# EAGLE design controller board (EAGLE 9.6.2)
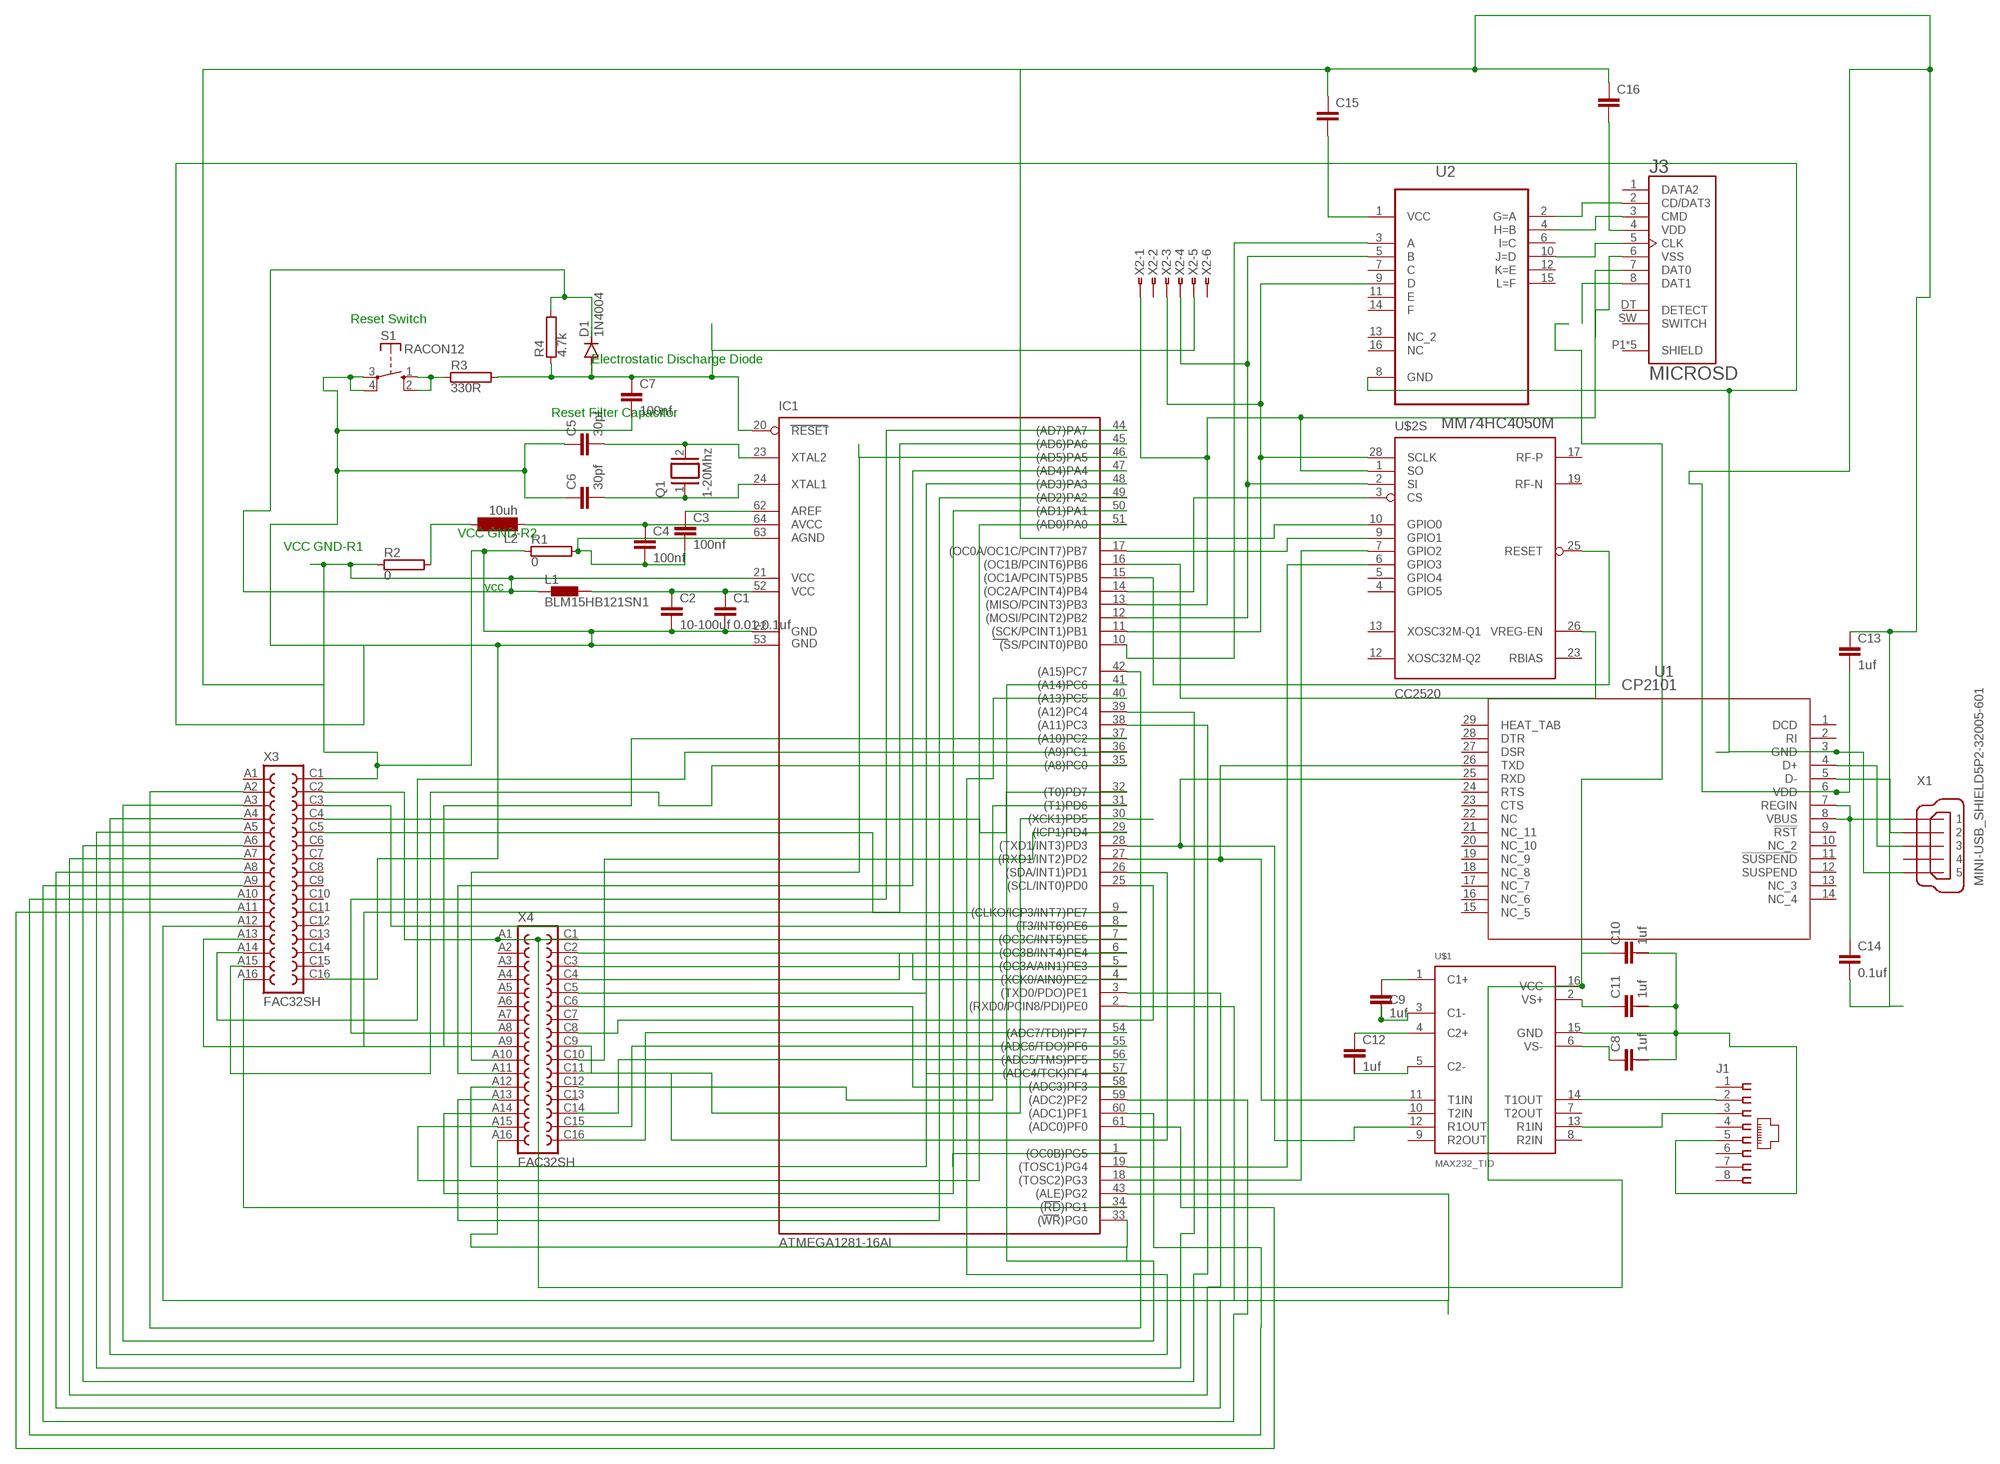
[diagram p0: schematic, sheet 1]

## Parts
C1  0.01-0.1uf  C2,5-3  [C2.5-3]
C2  10-100uf  C2,5-3  [C2.5-3]
C3  100nf  C2,5-3  [C2.5-3]
C4  100nf  C2,5-3  [C2.5-3]
C5  30pf  C2,5-3  [C2.5-3]
C6  30pf  C2,5-3  [C2.5-3]
C7  100nf  C2,5-3  [C2.5-3]
C8  1uf  C-2.5-5/2  [C2.5/5-2]
C9  1uf  C-2.5-5/2  [C2.5/5-2]
C10  1uf  C-2.5-5/2  [C2.5/5-2]
C11  1uf  C-2.5-5/2  [C2.5/5-2]
C12  1uf  C-2.5-5/2  [C2.5/5-2]
C13  1uf  C2,5-3  [C2.5-3]
C14  0.1uf  C2,5-3  [C2.5-3]
C15  C2,5-3  [C2.5-3]
C16  C2,5-3  [C2.5-3]
D1  1N4004  [DO41-10]
IC1  ATMEGA1281-16AI  [TQFP64]
J1  555248-1  [555248-1]
J3  MICROSD  [MOLEX_503182-1852]
L1  BLM15HB121SN1  [0402]
L2  10uh  BS11  [BS11]
Q1  1-20Mhz  XTAL  [Q]
R1  0  RMG100-H  [TO-247-2H]
R2  0  RMG100-H  [TO-247-2H]
R3  330R  RMG100-H  [TO-247-2H]
R4  4.7k  RMG100-H  [TO-247-2H]
S1  RACON12  [RACON12]
U1  CP2101  [MLP28_SIL]
U2  MM74HC4050M  [SOIC127P600X175-16N]
U$1  MAX232_TID  [R-PDSO-G16]
U$2  CC2520  [QFN50P500X500X100-29N]
X1  MINI-USB_SHIELD5P2-32005-601  [32005-601]
X2  FSIDE-6  [FSIDE-6]
X3  FAC32SH  [FAC32SH]
X4  FAC32SH  [FAC32SH]

## Nets
N$1: C1.1 C2.1 IC1.52(VCC1) L1.2
N$2: C5.2 IC1.23(XTAL2) Q1.2
N$3: C3.1 IC1.62(AREF)
N$4: C4.1 IC1.64(AVCC) L2.1
N$5: C3.2 C4.2 IC1.63(AGND) R1.2
N$7: L2.2 R2.2
N$8: C9.2 C9.3 U$1.3(C1-)
N$9: C6.2 IC1.24(XTAL1) Q1.1
N$10: R3.1 S1.1(S) S1.2(S)
N$11: C7.1 D1.A IC1.20(RESET) R3.2 R4.1 X2.5
N$12: IC1.34((RD)PG1) X3.A16
N$13: C9.1 U$1.1(C1+)
N$14: C12.1 U$1.4(C2+)
N$15: C12.2 U$1.5(C2-)
N$17: C11.1 U$1.2(VS+)
N$18: C8.1 U$1.6(VS-)
N$19: C8.2 C10.2 C11.2 J1.5 U$1.15(GND)
N$20: IC1.28((TXD1/INT3)PD3) U1.25(RXD) U$1.12(R1OUT)
N$21: IC1.27((RXD1/INT2)PD2) U1.26(TXD) U$1.11(T1IN)
N$23: U1.4(D+) X1.3
N$24: U1.5(D-) X1.2
N$25: C14.1 U1.7(REGIN) U1.8(VBUS) X1.1
N$26: C1.2 C2.2 C5.1 C6.1 C7.2 C13.1 C13.2 C14.2 C15.1 C16.1 D1.C IC1.21(VCC) IC1.22(GND) IC1.53(GND1) L1.1 R1.1 R2.1 R4.2 S1.3(P) S1.4(P) U1.3(GND) U1.6(VDD) U2.8(GND) U$2.10(S:GPIO0) X1.5 X3.C1 X3.C16
N$29: J1.2 U$1.14(T1OUT)
N$30: J1.3 U$1.13(R1IN)
N$31: IC1.18((TOSC2)PG3) U$2.7(S:GPIO2)
N$32: IC1.19((TOSC1)PG4) U$2.6(S:GPIO3)
N$33: IC1.11((SCK/PCINT1)PB1) U2.9(D) U$2.28(S:SCLK) X2.3
N$34: C15.2 U2.1(VCC)
N$36: IC1.10((SS/PCINT0)PB0) U2.3(A)
N$37: IC1.12((MOSI/PCINT2)PB2) U2.5(B) U$2.2(S:SI) X2.4
N$38: J3.2(CD/DAT3) U2.2(G=A)
N$39: J3.3(CMD) U2.4(H=B)
N$40: J3.5(CLK) U2.10(J=D)
N$41: J3.8(DAT1)
N$42: J3.6(VSS)
N$43: IC1.13((MISO/PCINT3)PB3) J3.7(DAT0) U$2.1(S:SO) X2.1
N$44: IC1.15((OC1A/PCINT5)PB5) U$2.25(S:RESET)
N$45: C16.2 J3.4(VDD)
N$47: IC1.16((OC1B/PCINT6)PB6) U$2.26(S:VREG-EN)
N$48: IC1.14((OC2A/PCINT4)PB4) U$2.3(S:CS)
N$49: IC1.17((OC0A/OC1C/PCINT7)PB7) U$2.9(S:GPIO1)
N$50: IC1.35((A8)PC0) X3.A15
N$51: IC1.36((A9)PC1) X3.A14
N$52: IC1.37((A10)PC2) X3.A13
N$53: IC1.1((OC0B)PG5) X4.C1
N$54: IC1.4((XCK0/AIN0)PE2) X4.C2
N$55: IC1.5((OC3A/AIN1)PE3) X4.C3
N$56: IC1.6((OC3B/INT4)PE4) X4.C4
N$57: IC1.57((ADC4/TCK)PF4) X4.C5
N$58: IC1.58((ADC3)PF3) X4.C6
N$59: C10.1 IC1.7((OC3C/INT5)PE5) U$1.16(VCC) X3.C2 X4.A1
N$60: IC1.8((T3/INT6)PE6) X3.C3
N$61: IC1.32((T0)PD7) X3.C4
N$62: IC1.9((CLKO/ICP3/INT7)PE7) X3.C5
N$63: IC1.54((ADC7/TDI)PF7) X4.C16
N$64: IC1.55((ADC6/TDO)PF6) X4.C15
N$65: IC1.56((ADC5/TMS)PF5) X4.C14
N$66: IC1.44((AD7)PA7) X4.A8
N$67: IC1.45((AD6)PA6) X4.A9
N$68: IC1.46((AD5)PA5) X4.A10
N$69: IC1.47((AD4)PA4) X4.A11
N$70: IC1.48((AD3)PA3) X4.A12
N$71: IC1.49((AD2)PA2) X4.A13
N$72: IC1.50((AD1)PA1) X4.A14
N$73: IC1.51((AD0)PA0) X4.A15
N$74: IC1.33((WR)PG0) X4.A16
N$75: IC1.25((SCL/INT0)PD0) X4.C8
N$76: IC1.26((SDA/INT1)PD1) X4.C9
N$77: IC1.29((ICP1)PD4) X4.C10
N$78: IC1.30((XCK1)PD5) X4.C11
N$79: IC1.31((T1)PD6) X4.C12
N$80: IC1.42((A15)PC7) X3.A2
N$81: IC1.41((A14)PC6) X3.A3
N$82: IC1.40((A13)PC5) X3.A4
N$83: IC1.39((A12)PC4) X3.A5
N$84: IC1.38((A11)PC3) X3.A6
N$85: IC1.3((TXD0/PDO)PE1) X3.A7
N$86: IC1.2((RXD0/PCIN8/PDI)PE0) X3.A8
N$87: IC1.59((ADC2)PF2) X3.A9
N$88: IC1.60((ADC1)PF1) X3.A10
N$89: IC1.61((ADC0)PF0) X3.A11
N$100: IC1.43((ALE)PG2) X3.A12
Unconnected: C8.3 C10.3 C11.3 C12.3 J1.1 J1.4 J1.6 J1.7 J1.8 J3.1(DATA2) J3.DT(DETECT) J3.P1(SHIELD) J3.P2(SHIELD) J3.P3(SHIELD) J3.P4(SHIELD) J3.P5(SHIELD) J3.SW(SWITCH) U1.1(DCD) U1.2(RI) U1.9(!RST) U1.10(NC_2) U1.11(!SUSPEND) U1.12(SUSPEND) U1.13(NC_3) U1.14(NC_4) U1.15(NC_5) U1.16(NC_6) U1.17(NC_7) U1.18(NC_8) U1.19(NC_9) U1.20(NC_10) U1.21(NC_11) U1.22(NC) U1.23(CTS) U1.24(RTS) U1.27(DSR) U1.28(DTR) U1.29(HEAT_TAB) U2.6(I=C) U2.7(C) U2.11(E) U2.12(K=E) U2.13(NC_2) U2.14(F) U2.15(L=F) U2.16(NC) U$1.7(T2OUT) U$1.8(R2IN) U$1.9(R2OUT) U$1.10(T2IN) U$2.4(S:GPIO5) U$2.5(S:GPIO4) U$2.12(S:XOSC32M-Q2) U$2.13(S:XOSC32M-Q1) U$2.15(NC) U$2.17(S:RF-P) U$2.18(NC) U$2.19(S:RF-N) U$2.21(NC) U$2.23(S:RBIAS) X1.4 X1.M1(S1) X1.M2(S2) X2.2 X2.6 X3.A1 X3.C6 X3.C7 X3.C8 X3.C9 X3.C10 X3.C11 X3.C12 X3.C13 X3.C14 X3.C15 X4.A2 X4.A3 X4.A4 X4.A5 X4.A6 X4.A7 X4.C7 X4.C13

## Notes on the sheet
- Reset Switch
- Electrostatic Discharge Diode
- Reset Filter Capacitor
- VCC GND-R2
- VCC GND-R1
- vcc

## Power pins joined to a net without a drawn wire
AGND: U$2.29(P:AGND)
AVDD: U$2.11(P:AVDD) U$2.14(P:AVDD) U$2.16(P:AVDD) U$2.20(P:AVDD) U$2.22(P:AVDD)
AVDD-GUARD: U$2.24(P:AVDD-GUARD)
DCOUPL: U$2.27(P:DCOUPL)
DVDD: U$2.8(P:DVDD)

## Library data of the parts
C1-C7 C13-C16 = capacitor-wima:C: CAPACITOR naming: grid - package width
C8-C12 = capacitor-wima:C-: CAPACITOR for alternative placement naming: default grid - extended grid/package width
D1 = diode:1N4004: DIODE general purpose rectifier, 1 A
IC1 = atmel-2005:ATMEGA1281*: MICROCONTROLLER 128 Kbytes FLASH 4 Kbytes EEPROM 8 Kbytes SRAM 54 General Purpose I/O pins 6-channels 16-bit PWM 2 x Serial USARTs 8-channels 10-bit A/D
J1 = con-amp:555248-1: AMP connector
J3 = SD card slots:MICROSD: Conn Micro SD Card M 8 POS 1.09mm Solder RA SMD Embossed T/R 0.5A/Contact Check prices <https://pricing.snapeda.com/search/part/5031821852/?ref=eda>; AVAILABILITY: Good; DESCRIPTION: 10 (8 + 2) Position Card Connector microSD™ Surface Mount, Right Angle Gold; MF: Molex; MP: 5031821852; PACKAGE: None; PRICE: None; PURCHASE-URL: https://pricing.snapeda.com/search/part/5031821852/?ref=eda
L1 = inductors:BLM15H: EMIFIL (R) Chip Ferrite Bead for GHz Noise Source: http://www.murata.com/ Ferrite Bead BLM15H.pdf
L2 = inductor-neosid:BS: INDUCTOR nominal inductance, magnetically screened; OC_FARNELL: unknown; OC_NEWARK: unknown
Q1 = special:XTAL: CRYSTAL
R1-R4 = resistor-power:RMG100: TO-247 Power Resistor - RMG 100 Series Source: www.token.com.tw .. power-resistor-rmg100pdf; OC_FARNELL: unknown; OC_NEWARK: unknown
S1 = switch-misc:RACON12: ITT SWITCH
U1 = CP2101:CP2101; BUILT_BY: EMA_UL_Team; MANUFACTURER_PART_NUMBER: CP2101; SOURCELIBRARY: Silicon_2010-04-20; VENDOR: Silicon Labs
U2 = MM74HC4050M:MM74HC4050M: Hex Inverting Logic Level Down Converter Check prices <https://pricing.snapeda.com/search/part/MM74HC4050M/?ref=eda> mm74hc4050m, logic level shifter; AVAILABILITY: Warning; DESCRIPTION: Buffer, Non-Inverting 6 Element 1 Bit per Element Push-Pull Output 16-TSSOP; MF: ON Semiconductor; MP: MM74HC4050M; PACKAGE: SOIC-16 Fairchild Semiconductor; PRICE: None; PURCHASE-URL: https://pricing.snapeda.com/search/part/MM74HC4050M/?ref=eda
U$1 = max232 ti_n:MAX232_TI: MAX232, Texas Instruments Version
U$2 = ti CCxxxx series-v2:CC2520: 2.4 GHZ IEEE 802.15.4/ZIGBEE® RF TRANSCEIVER
X1 = con-cypressindustries:MINI-USB_SHIELD5P2-: MINI USB-B R/A DIP 5pol. Source: www.cypressindustries.com; OC_FARNELL: unknown; OC_NEWARK: unknown
X2 = con-amp:FSIDE-6: AMP connector
X3 X4 = con-vg:FAC32SH: CONNECTOR female, 32 pins, block, type B, rows AC, grid 5.08 mm

## Board
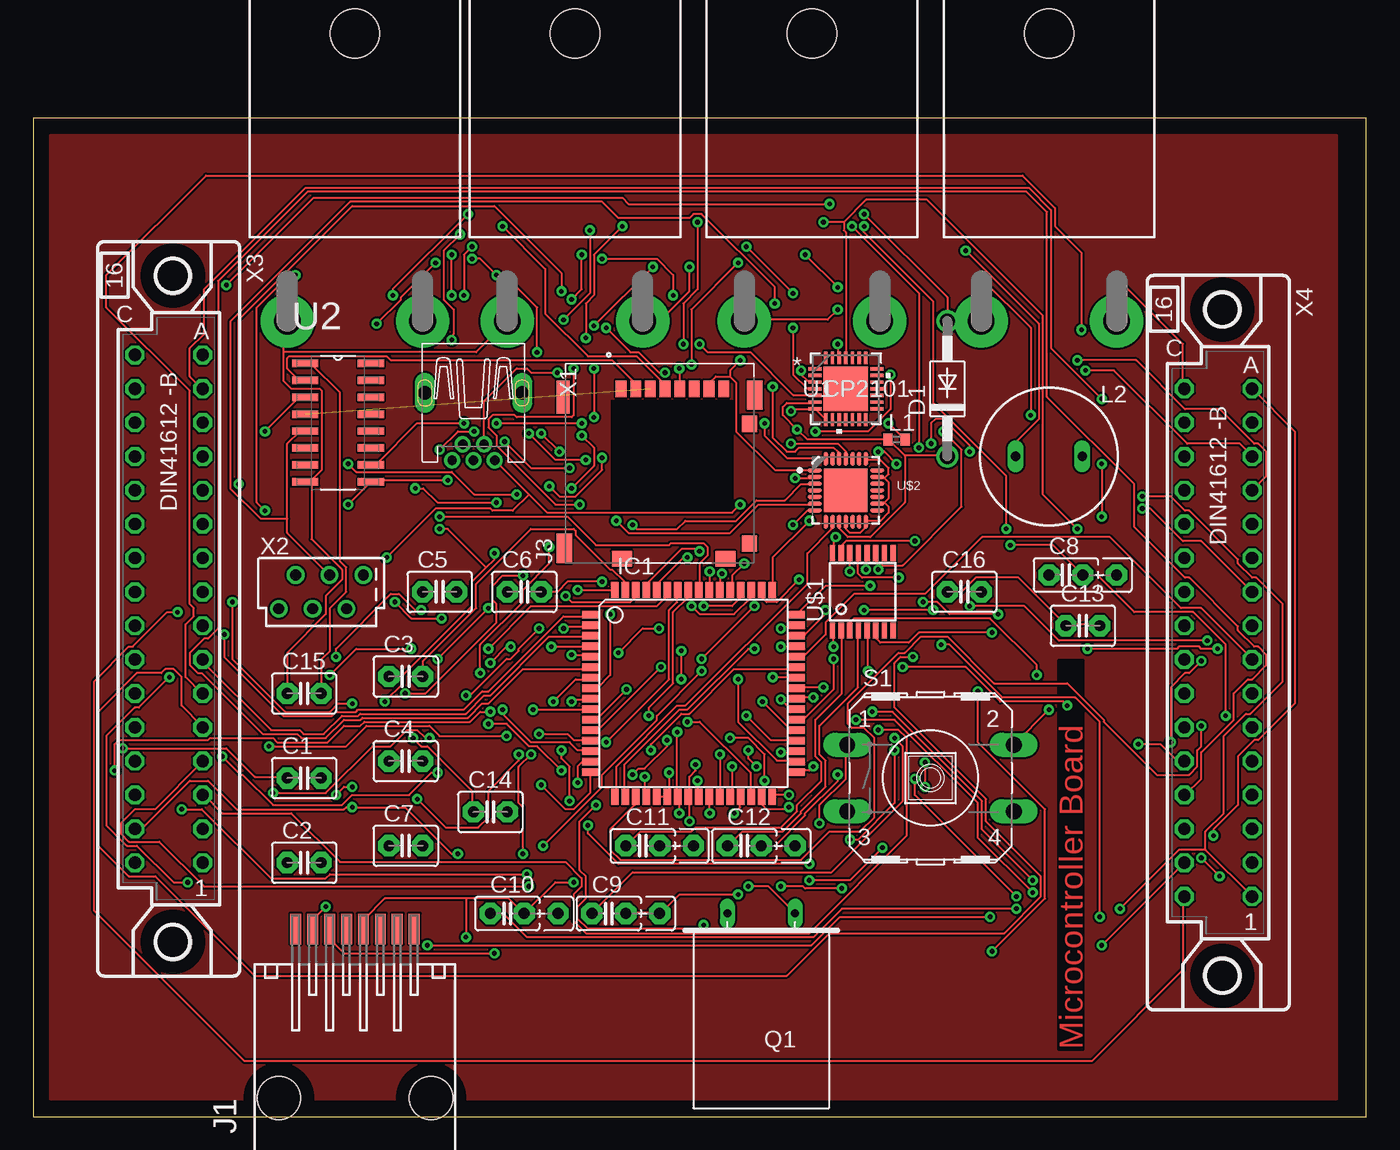
[diagram p1: board, top side]
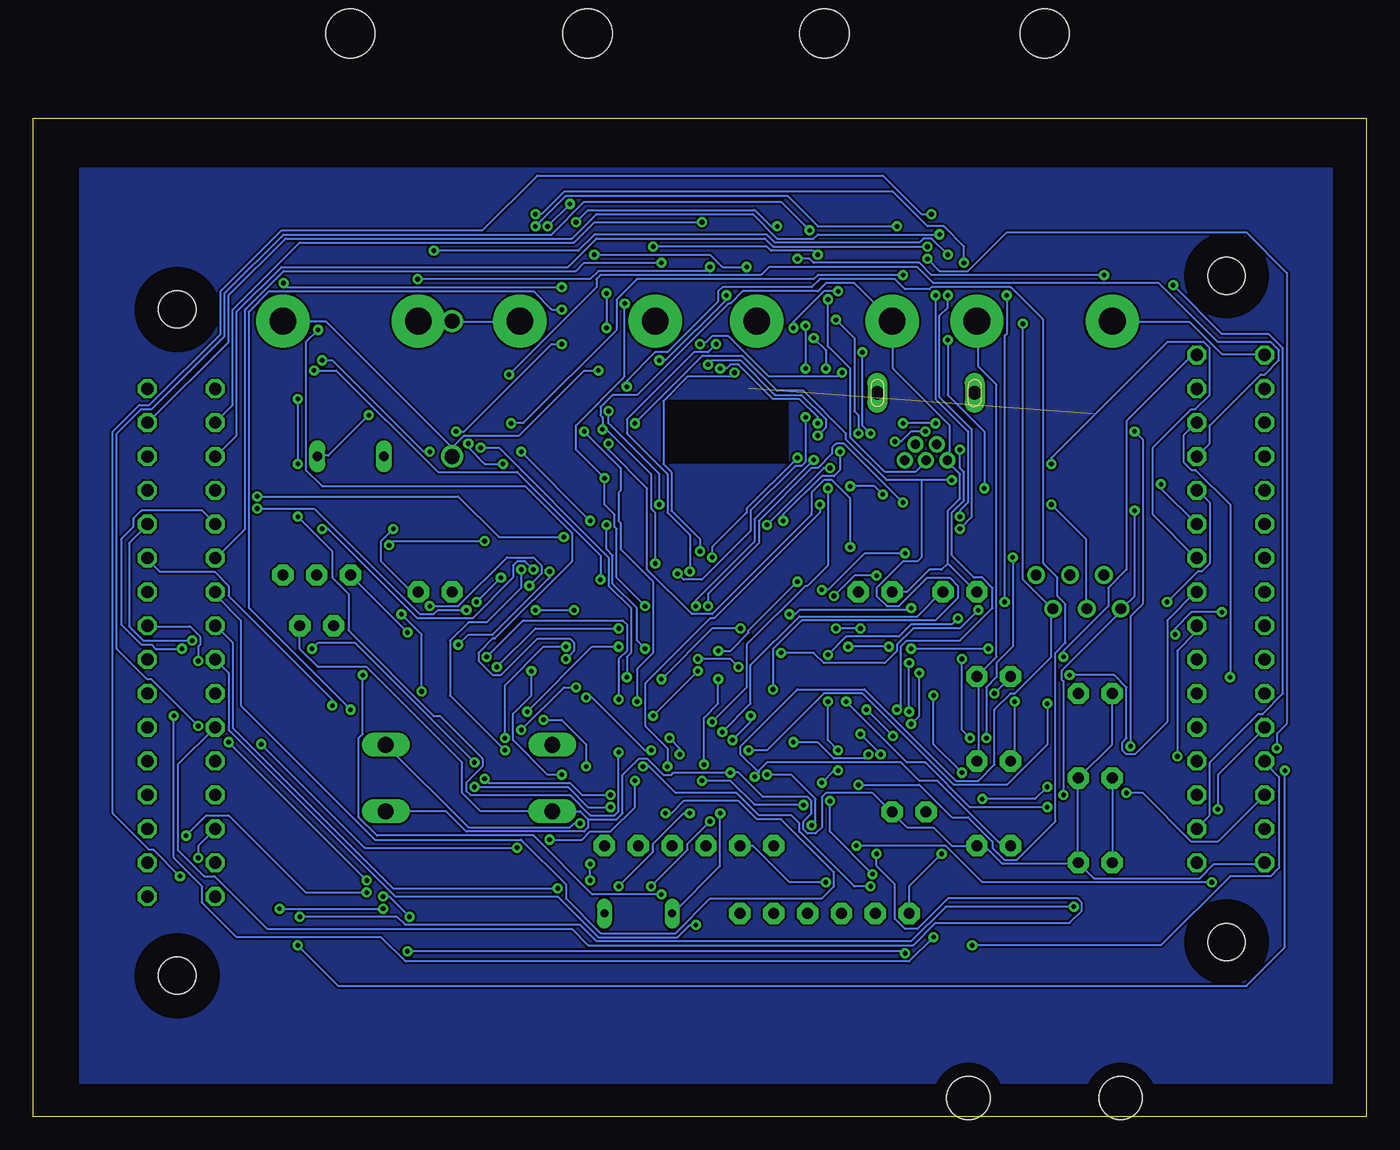
[diagram p2: board, bottom side, seen from below]

Size 100 x 74.92 mm. Coordinates in mm from the lower left corner, seen from the top.
Outline: 0,0 100,0 100,74.92 0,74.92 0,0
Copper layers (1*16): Top 0.035mm / dielectric 1.5mm / Bottom 0.035mm
Design rules "default": minimum track width 6mil, minimum drill 0.35mm, track to track 6mil, track to pad 6mil, pad to pad 6mil, via to via 6mil, smd to smd 6mil, copper to edge 40mil, drill to drill 6mil, minimum pad ring 10mil, minimum via ring 8mil, stop-mask expansion 4mil, vias tented up to drill 0mil, thermal gap 10mil

### Footprints (pad centres in the part's own frame; a part is rotated, then mirrored left to right if it is on the bottom)
C2.5-3 = drill 0.813 pad 1.6 octagon: 1 -1.27,0; 2 1.27,0
C2.5/5-2 = drill 0.813 pad 1.6 octagon: 1 -1.27,0; 2 1.27,0; 3 3.81,0
DO41-10 = drill 1.118: A 5.08,0; C -5.08,0
TQFP64 = smd 1.194 x 0.559: 1 -7.76,5.905; 2 -7.76,5.118; 3 -7.76,4.331; 4 -7.76,3.543; 5 -7.76,2.756; 6 -7.76,1.968; 7 -7.76,1.181; 8 -7.76,0.394; 9 -7.76,-0.394; 10 -7.76,-1.181; 11 -7.76,-1.968; 12 -7.76,-2.756; 13 -7.76,-3.543; 14 -7.76,-4.331; 15 -7.76,-5.118; 16 -7.76,-5.905; 33 7.76,-5.905; 34 7.76,-5.118; 35 7.76,-4.331; 36 7.76,-3.543; 37 7.76,-2.756; 38 7.76,-1.968; 39 7.76,-1.181; 40 7.76,-0.394; 41 7.76,0.394; 42 7.76,1.181; 43 7.76,1.968; 44 7.76,2.756; 45 7.76,3.543; 46 7.76,4.331; 47 7.76,5.118; 48 7.76,5.905 | smd 0.559 x 1.194: 17 -5.905,-7.76; 18 -5.118,-7.76; 19 -4.331,-7.76; 20 -3.543,-7.76; 21 -2.756,-7.76; 22 -1.968,-7.76; 23 -1.181,-7.76; 24 -0.394,-7.76; 25 0.394,-7.76; 26 1.181,-7.76; 27 1.968,-7.76; 28 2.756,-7.76; 29 3.543,-7.76; 30 4.331,-7.76; 31 5.118,-7.76; 32 5.905,-7.76; 49 5.905,7.76; 50 5.118,7.76; 51 4.331,7.76; 52 3.543,7.76; 53 2.756,7.76; 54 1.968,7.76; 55 1.181,7.76; 56 0.394,7.76; 57 -0.394,7.76; 58 -1.181,7.76; 59 -1.968,7.76; 60 -2.756,7.76; 61 -3.543,7.76; 62 -4.331,7.76; 63 -5.118,7.76; 64 -5.905,7.76
555248-1 = smd 0.813 x 2.286: 1 -4.445,11.533; 2 -3.175,11.533; 3 -1.905,11.533; 4 -0.635,11.533; 5 0.635,11.533; 6 1.905,11.533; 7 3.175,11.533; 8 4.445,11.533 | hole 3.251: -5.715,-1.143; 5.715,-1.143
MOLEX_503182-1852 = smd 0.8 x 1.24: 1 -2.9,6.355; 2 -1.8,6.355; 3 -0.7,6.355; 4 0.4,6.355; 5 1.5,6.355; 6 2.6,6.355; 7 3.7,6.355; 8 4.8,6.355 | smd 1.16 x 1.2: DT 6.74,-5.275 | smd 0.95 x 2.5: P1 -7.245,5.725 | smd 1.15 x 2.2: P2 7.145,5.875; P3 -7.145,-5.605 | smd 1.5 x 1.15: P4 -2.84,-6.4; P5 4.94,-6.4 | smd 1.16 x 1.25: SW 6.74,3.725
0402 = smd 0.7 x 0.9: 1 -0.65,0; 2 0.65,0
BS11 = drill 0.7 long: 1 -2.5,0; 2 2.5,0
Q = drill 0.61 long: 1 -2.54,-7.62; 2 2.54,-7.62
TO-247-2H = drill 2 pad 4: 1 -5.08,-21.59; 2 5.08,-21.59 | hole 3.7: 0,0
RACON12 = drill 1.194 long: 1 -6.248,2.489; 2 6.248,2.489; 3 -6.248,-2.489; 4 6.248,-2.489
MLP28_SIL = smd 0.965 x 0.254: 1 -2.324,1.5; 2 -2.324,1; 3 -2.324,0.5; 4 -2.324,0; 5 -2.324,-0.5; 6 -2.324,-1; 7 -2.324,-1.5; 15 2.324,-1.5; 16 2.324,-1; 17 2.324,-0.5; 18 2.324,0; 19 2.324,0.5; 20 2.324,1; 21 2.324,1.5 | smd 0.254 x 0.965: 8 -1.5,-2.324; 9 -1,-2.324; 10 -0.5,-2.324; 11 0,-2.324; 12 0.5,-2.324; 13 1,-2.324; 14 1.5,-2.324; 22 1.5,2.324; 23 1,2.324; 24 0.5,2.324; 25 0,2.324; 26 -0.5,2.324; 27 -1,2.324; 28 -1.5,2.324 | smd 3.353 x 3.353: 29 0,0
SOIC127P600X175-16N = smd 1.981 x 0.559: 1 -2.464,4.445; 2 -2.464,3.175; 3 -2.464,1.905; 4 -2.464,0.635; 5 -2.464,-0.635; 6 -2.464,-1.905; 7 -2.464,-3.175; 8 -2.464,-4.445; 9 2.464,-4.445; 10 2.464,-3.175; 11 2.464,-1.905; 12 2.464,-0.635; 13 2.464,0.635; 14 2.464,1.905; 15 2.464,3.175; 16 2.464,4.445
R-PDSO-G16 = smd 0.4 x 1.2: 1 -2.275,-2.9; 2 -1.625,-2.9; 3 -0.975,-2.9; 4 -0.325,-2.9; 5 0.325,-2.9; 6 0.975,-2.9; 7 1.625,-2.9; 8 2.275,-2.9; 9 2.275,2.9; 10 1.625,2.9; 11 0.975,2.9; 12 0.325,2.9; 13 -0.325,2.9; 14 -0.975,2.9; 15 -1.625,2.9; 16 -2.275,2.9
QFN50P500X500X100-29N = smd 1.05 x 0.3: 1 -2.35,1.5; 2 -2.35,1; 3 -2.35,0.5; 4 -2.35,0; 5 -2.35,-0.5; 6 -2.35,-1; 7 -2.35,-1.5; 15 2.35,-1.5; 16 2.35,-1; 17 2.35,-0.5; 18 2.35,0; 19 2.35,0.5; 20 2.35,1; 21 2.35,1.5 | smd 0.3 x 1.05: 8 -1.5,-2.35; 9 -1,-2.35; 10 -0.5,-2.35; 11 0,-2.35; 12 0.5,-2.35; 13 1,-2.35; 14 1.5,-2.35; 22 1.5,2.35; 23 1,2.35; 24 0.5,2.35; 25 0,2.35; 26 -0.5,2.35; 27 -1,2.35; 28 -1.5,2.35 | smd 3.25 x 3.25: 29 0,0
32005-601 = drill 0.7 pad 1.016: 1 2.825,1.6; 2 1.625,0.8; 3 2.825,0; 4 1.625,-0.8; 5 2.825,-1.6 | drill 1 pad 1.422 long: M1 -2.225,3.65; M2 -2.225,-3.65
FSIDE-6 = drill 0.813: 1 -3.175,-1.27; 2 -1.905,1.27; 3 -0.635,-1.27; 4 0.635,1.27; 5 1.905,-1.27; 6 3.175,1.27
FAC32SH = drill 0.914 octagon: A1 -2.54,19.05; A2 -2.54,16.51; A3 -2.54,13.97; A4 -2.54,11.43; A5 -2.54,8.89; A6 -2.54,6.35; A7 -2.54,3.81; A8 -2.54,1.27; A9 -2.54,-1.27; A10 -2.54,-3.81; A11 -2.54,-6.35; A12 -2.54,-8.89; A13 -2.54,-11.43; A14 -2.54,-13.97; A15 -2.54,-16.51; A16 -2.54,-19.05; C1 2.54,19.05; C2 2.54,16.51; C3 2.54,13.97; C4 2.54,11.43; C5 2.54,8.89; C6 2.54,6.35; C7 2.54,3.81; C8 2.54,1.27; C9 2.54,-1.27; C10 2.54,-3.81; C11 2.54,-6.35; C12 2.54,-8.89; C13 2.54,-11.43; C14 2.54,-13.97; C15 2.54,-16.51; C16 2.54,-19.05 | hole 2.794: -0.305,24.994; -0.305,-24.994

### Placement (x,y rotation side)
C1  20.32,25.4 0 top
C2  20.32,19.05 0 top
C3  27.94,33.02 0 top
C4  27.94,26.67 0 top
C5  30.48,39.37 0 top
C6  36.83,39.37 0 top
C7  27.94,20.32 0 top
C8  77.47,40.64 0 top
C9  43.18,15.24 0 top
C10  35.56,15.24 0 top
C11  45.72,20.32 0 top
C12  53.34,20.32 0 top
C13  78.74,36.83 0 top
C14  34.29,22.86 0 top
C15  20.32,31.75 0 top
C16  69.85,39.37 0 top
D1  68.58,54.61 90 top
IC1  49.53,31.75 0 top
J1  24.13,2.54 0 top
J3  46.99,48.26 0 top
L1  64.77,50.8 0 top
L2  76.2,49.53 0 top
Q1  54.61,7.62 180 top
R1  24.13,81.28 0 top
R2  40.64,81.28 0 top
R3  58.42,81.28 0 top
R4  76.2,81.28 0 top
S1  67.31,25.4 0 top
U1  60.96,54.61 0 top
U2  22.86,52.07 0 top
U$1  62.23,39.37 0 top
U$2  60.96,46.99 0 top
X1  33.02,52.07 270 top
X2  21.59,39.37 0 top
X3  10.16,38.1 180 top
X4  88.9,35.56 180 top

### Tracks (layer width: path | path; a pad name or v marks a point on that pad's centre or on a via)
AVDD
  Top 0.152: U$2.11 60.96,44.09 61.27,43.79 62.03,43.79 62.48,44.25 62.48,44.55 U$2.14 62.48,44.7 63.55,44.7 64.16,45.31 64.16,45.77 63.86,46.08 | 63.86,46.08 63.4,46.08 U$2.16 | 63.86,46.08 64.16,46.38 64.16,47.6 63.86,47.9 | 63.86,47.9 63.4,47.9 U$2.20 | 63.86,47.9 64.16,48.21 64.16,48.67 63.55,49.28 62.48,49.28 U$2.22
GND
  pour Bottom: 2.54,71.12 96.52,71.12 96.52,2.54 2.54,2.54
  pour Top: 1.27,73.66 97.79,73.66 97.79,72.39 97.79,1.27 1.27,1.27
N$1  (via drill 0.35)
  Top 0.152: v64.16,52.02 65.38,50.8 L1.2 | v37.8,57.35 37.8,60.71 35.36,63.14 v34.75,63.14 33.53,64.36 v32.92,64.36 | v37.19,51.26 39.17,49.28 v41.45,49.28 | v50.29,38.3 52.43,38.3 53.03,38.91 53.03,39.37 IC1.52 | v6.71,27.64 14.48,27.64 16.61,25.5 19.05,25.5 C1.1
  Bottom 0.152: C1.1 C2.1 | v64.16,52.02 63.25,52.02 56.24,59.03 56.24,61.32 54.71,62.84 41.45,62.84 41.15,63.14 v34.75,63.14 | v37.8,57.35 37.8,51.87 v37.19,51.26 | v41.45,49.28 45.87,44.86 45.87,43.18 50.29,38.76 v50.29,38.3 | v6.71,27.64 6.71,28.7 5.94,29.46 5.94,63.3 8.99,66.34 26.98,66.34 29.87,63.45 32,63.45 v32.92,64.36
N$2  (via drill 0.35)
  Top 0.152: v48.46,22.76 48.46,23.98 IC1.23 48.31,24.13 v48.31,28.85
  Bottom 0.152: v48.46,22.76 48.46,18.8 51.97,15.29 Q1.2 | v48.31,28.85 46.18,30.99 46.18,33.88 42.52,37.54 33.68,37.54 31.85,39.37 C5.2
N$3  (via drill 0.35)
  Top 0.152: v39.93,39.06 40.39,38.61 44.81,38.61 45.11,38.91 45.11,39.37 IC1.62 | v36.73,40.59 35.2,40.59 34.44,39.83 34.44,38.76 34.75,38.46 34.75,37.08 29.41,31.75 v27.89,31.75
  Bottom 0.152: v39.93,39.06 38.41,40.59 v36.73,40.59 | v27.89,31.75 26.67,32.97 C3.1
N$4  (via drill 0.35)
  Top 0.152: v40.84,39.52 43.59,39.52 IC1.64 | v34.59,42.27 34.59,41.81 33.98,41.2 | 33.98,41.2 32.92,40.13 32.92,38.3 27.74,33.12 27.74,32.51 v26.36,31.14 | v69.95,64.97 75.44,59.49 75.44,52.32 73.76,50.65 73.76,49.58 L2.1 | v31.39,61.62 v31.39,64.67 | v30.48,44.09 31.09,44.09 33.98,41.2
  Bottom 0.152: v40.84,39.52 40.39,39.52 37.64,42.27 v34.59,42.27 | v26.36,31.14 26.36,27.03 26.67,26.72 C4.1 | v69.95,64.97 59.13,64.97 57.91,66.19 44.96,66.19 44.35,65.58 33.53,65.58 33.22,65.89 32.61,65.89 v31.39,64.67 | v31.39,61.62 31.39,60.71 32,60.1 32,54 29.57,51.56 29.57,45.01 v30.48,44.09
N$5
  Top 0.152: IC1.63 44.35,39.52 44.35,40.13 43.43,41.05 43.28,41.05 40.69,43.64 40.69,43.94 40.54,44.09 37.34,44.09 33.22,39.98 33.22,38.15 29.26,34.19 29.26,33.12 C3.2
  Bottom 0.152: C4.2 29.11,26.72 29.11,32.97 C3.2 27.74,34.49 27.74,54.91 29.11,56.29 29.11,59.64 R1.2
N$7  (via drill 0.35)
  Top 0.152: v74.83,52.63 74.83,59.18 v71.17,62.84 | v49.23,63.75 49.23,61.93 47.09,59.79 45.72,59.79 R2.2
  Bottom 0.152: v74.83,52.63 77.88,49.58 78.64,49.58 L2.2 | v71.17,62.84 58.22,62.84 57.61,63.45 49.53,63.45 v49.23,63.75
N$8  (via drill 0.35)
  Top 0.152: v75.29,33.12 75.29,33.88 71.78,37.39 61.57,37.39 61.27,37.08 61.27,36.47 U$1.3 | v52.88,16.66 48.46,16.66 47.09,15.29 C9.3 46.94,15.29 44.5,15.29 C9.2
  Bottom 0.152: v75.29,33.12 75.29,28.7 75.59,28.4 75.59,22.45 74.22,21.08 62.48,21.08 58.06,16.66 v52.88,16.66
N$9  (via drill 0.35)
  Top 0.152: v49.23,22.15 49.23,23.98 IC1.24 49.23,24.13 49.23,25.5 49.68,25.96 v49.68,26.42 | v53.65,17.27 55.17,17.27 57.15,15.29 Q1.1 | C6.2 39.32,39.37 40.08,40.13 v42.67,40.13 | v48.62,32.82 v48.62,34.95
  Bottom 0.152: v49.23,22.15 50.9,20.47 50.9,20.02 v53.65,17.27 | v42.67,40.13 46.33,36.47 46.33,36.32 47.7,34.95 v48.62,34.95 | v48.62,32.82 48.62,30.99 49.68,29.92 v49.68,26.42
N$10  (via drill 0.35)
  Top 0.152: v58.98,22 58.98,23.37 60.96,25.35 60.96,27.79 S1.1 | v60.35,60.55 59.59,59.79 53.34,59.79 R3.1 | S1.2 v76.2,30.53
  Bottom 0.152: v58.98,22 59.44,22 59.74,21.69 67.36,21.69 S1.2 | v60.35,60.55 61.11,60.55 62.48,61.93 82.3,61.93 83.82,60.4 83.82,38.15 v76.2,30.53
N$11  (via drill 0.35)
  Top 0.152: 68.58,59.79 71.02,59.79 R4.1 | v45.87,25.5 45.87,24.13 IC1.20 | 68.58,59.79 68.58,61.47 v62.33,67.72 | v30.18,64.06 27.58,61.47 27.58,61.32 v25.76,59.49 | 68.58,59.79 D1.A
  Bottom 0.152: R3.2 63.55,59.64 68.58,59.64 D1.A | 45.57,25.81 v45.87,25.5 | 45.57,25.81 45.57,25.96 44.96,26.57 34.9,26.57 33.53,25.2 32.16,25.2 27.28,20.32 C7.1 | 45.57,25.81 46.94,27.18 46.94,27.79 42.67,32.05 37.64,32.05 30.79,25.2 29.11,25.2 27.89,26.42 27.89,30.53 26.67,31.75 26.36,31.75 23.62,34.49 23.62,38 X2.5 23.62,38.15 25.76,40.28 v25.76,59.49 | v62.33,67.72 61.87,67.72 60.2,69.39 35.51,69.39 32.92,66.8 31.7,66.8 30.18,65.28 v30.18,64.06
N$12  (via drill 0.35)
  Top 0.152: v52.88,32.82 52.88,29.62 55.78,26.72 57.15,26.72 IC1.34 | v46.94,36.63 45.72,36.63 v43.89,34.8 | v29.11,38 28.65,38 27.43,39.22 26.82,39.22 22.71,35.1 v22.71,34.49
  Bottom 0.152: v52.88,32.82 49.07,36.63 v46.94,36.63 | v43.89,34.8 41.45,34.8 40.69,34.04 36.12,34.04 35.2,34.95 35.2,35.41 33.98,36.63 30.48,36.63 v29.11,38 | v22.71,34.49 22.71,34.95 19.36,38.3 19.36,39.68 17.98,41.05 17.98,52.17 13.11,57.05 12.8,57.05 X3.A16
N$13  (via drill 0.35)
  Top 0.152: v60.05,35.26 60.05,36.32 U$1.1 | v64.62,28.4 65.23,27.79 65.23,23.67 59.89,18.34 44.96,18.34 41.91,15.29 C9.1
  Bottom 0.152: v60.05,35.26 61.72,35.26 64.62,32.36 v64.62,28.4
N$14
  Top 0.152: U$1.4 61.87,36.32 61.87,32.21 58.98,29.31 58.98,27.18 59.44,26.72 59.44,24.74 57.61,22.91 57.61,22.76 56.24,21.39 53.19,21.39 52.12,20.32 C12.1
N$15  (via drill 0.35)
  Top 0.152: v62.64,33.43 62.64,36.32 U$1.5 | v60.35,25.65 60.35,25.2 57.91,22.76 57.91,22.61 55.63,20.32 C12.2
  Bottom 0.152: v62.64,33.43 62.64,31.6 64.01,30.23 64.01,28.25 61.42,25.65 v60.35,25.65
N$17
  Top 0.152: U$1.2 60.66,36.32 60.66,31.75 58.67,29.77 58.67,27.03 59.13,26.57 59.13,25.2 57.3,23.37 57.3,22.91 56.08,21.69 49.68,21.69 49.38,21.39 45.57,21.39 44.5,20.32 C11.1
N$18  (via drill 0.35)
  Top 0.152: v71.93,36.32 66.45,36.32 65.68,35.56 63.55,35.56 63.25,35.87 63.25,36.32 U$1.6
  Bottom 0.152: v71.93,36.32 76.2,40.59 C8.1
N$19  (via drill 0.35)
  Top 0.152: v66.14,43.18 60.96,43.18 60.66,42.88 60.66,42.42 U$1.15 | v73.3,42.88 76.5,42.88 C8.2 78.79,40.59 79.86,40.59 82.6,37.85 87.02,37.85 89.46,35.41 v89.46,30.07 | 32.46,16.36 35.66,16.36 36.73,15.29 C10.2 39.17,17.58 v40.54,17.58 | 32.46,16.36 26.36,16.36 24.84,14.83 24.84,14.22 J1.5 | 32.46,16.36 v32.46,13.46
  Bottom 0.152: v66.14,43.18 73,43.18 v73.3,42.88 | C11.2 46.02,20.32 43.28,17.58 v40.54,17.58 | v89.46,30.07 89.46,19.41 87.33,17.27 87.33,16.05 84.73,13.46 73.91,13.46 72.08,11.63 34.29,11.63 v32.46,13.46
N$20  (via drill 0.35)
  Top 0.152: U1.25 60.96,66.34 60.81,66.5 60.81,67.11 | 60.81,67.11 62.48,68.78 67.06,68.78 75.74,60.1 75.74,46.69 v78.33,44.09 | v62.48,41.05 62.48,42.27 U$1.12 | v52.43,26.26 52.43,24.13 IC1.28 | v41,45.92 39.17,45.92 34.75,50.34 34.75,51.11 34.14,51.71 34.14,52.32 34.44,52.63 36.12,52.63 36.27,52.48 40.39,52.48 40.54,52.63 v40.54,56.13 | v41.45,58.42 41.45,61.01 42.06,61.62 42.06,64.67 v44.2,66.8 | 60.81,67.11 v59.28,67.11
  Bottom 0.152: v78.33,44.09 77.88,44.09 71.17,37.39 67.06,37.39 64.01,40.44 64.01,41.35 63.7,41.66 63.09,41.66 v62.48,41.05 | v52.43,26.26 52.43,27.64 54.1,29.31 54.1,32.51 49.23,37.39 48.92,37.39 41,45.31 v41,45.92 | v40.54,56.13 40.54,57.51 v41.45,58.42 | v44.2,66.8 44.65,66.8 45.87,68.02 58.37,68.02 v59.28,67.11
N$21  (via drill 0.35)
  Top 0.152: v60.35,57.96 60.35,57.05 U1.26 | v68.28,51.41 69.65,50.04 69.65,45.77 65.23,41.35 63.7,41.35 | 63.7,41.35 63.55,41.35 63.25,41.66 63.25,42.27 U$1.11 | v51.51,27.18 51.51,24.13 IC1.27 | v52.27,28.4 53.65,28.4 54.86,27.18 v54.86,25.2 | v61.27,20.78 61.87,20.78 64.62,23.52 v64.62,27.48 | 63.7,41.35 v63.4,41.05
  Bottom 0.152: v60.35,57.96 61.11,57.96 67.67,51.41 v68.28,51.41 | v51.51,27.18 51.51,27.64 v52.27,28.4 | v54.86,25.2 54.86,23.22 56.69,21.39 58.22,21.39 58.83,20.78 v61.27,20.78 | v64.62,27.48 68.73,31.6 68.73,35.71 67.36,37.08 65.99,37.08 63.4,39.68 v63.4,41.05
N$23  (via drill 0.35)
  Top 0.152: U1.4 58.06,54.61 57,55.68 v57,59.18 | v53.49,65.28 v57,61.77 | v41.15,64.67 41.15,62.08 v40.39,61.32
  Bottom 0.152: v57,61.77 v57,59.18 | v53.49,65.28 44.96,65.28 44.65,64.97 41.45,64.97 v41.15,64.67 | v40.39,61.32 40.39,57.81 38.71,56.13 38.71,50.95 36.12,48.36 33.83,48.36 33.07,49.12 X1.3
N$24  (via drill 0.35)
  Top 0.152: v49.99,57.96 50.6,57.35 53.8,57.35 57,54.15 58.52,54.15 U1.5 | v39.32,55.83 37.34,55.83 37.03,56.13 36.27,56.13 33.83,53.7 33.83,50.49 X1.2
  Bottom 0.152: v49.99,57.96 49.68,57.96 49.07,58.57 47.85,58.57 44.81,55.52 39.62,55.52 v39.32,55.83
N$25  (via drill 0.35)
  Top 0.152: U1.8 59.44,52.32 58.67,53.09 U1.7 58.52,53.09 57,53.09 v56.84,52.93 | v53.03,45.92 52.43,45.31 38.56,45.31 37.19,46.69 | 37.19,46.69 34.75,49.12 X1.1 | v28.5,28.4 29.11,27.79 29.57,27.79 32.92,24.44 32.92,22.91 C14.1 | v26.52,41.96 30.18,45.62 34.29,45.62 34.44,45.47 35.97,45.47 37.19,46.69
  Bottom 0.152: v56.84,52.93 56.84,52.02 53.03,48.21 v53.03,45.92 | v28.5,28.4 28.5,32.21 27.74,32.97 27.74,34.04 26.52,35.26 v26.52,41.96
N$26  (via drill 0.35)
  Top 0.152: 65.38,49.58 64.16,50.8 L1.1 58.06,50.8 v57.3,51.56 56.24,52.63 56.24,53.24 56.54,53.54 58.52,53.54 U1.6 | 65.38,49.58 68.58,49.58 D1.C | v57.61,55.98 57.61,55.68 58.06,55.22 58.52,55.22 U1.3 | 65.38,49.58 65.38,46.08 62.79,43.48 61.11,43.48 60.5,44.09 60.5,44.55 U$2.10 | v53.34,41.5 52.43,40.59 52.43,39.52 IC1.53 | C13.2 80.01,36.93 77.57,36.93 C13.1 77.42,36.93 73.91,40.44 70.71,40.44 69.65,39.37 C16.1 | IC1.21 46.79,23.98 47.55,23.98 IC1.22 47.7,24.13 v47.7,25.81 | 20.88,47.75 20.42,47.75 U2.8 20.88,47.75 | 20.88,47.75 21.64,48.51 21.64,54.46 21.49,54.61 19.36,54.61 18.75,55.22 18.75,57.35 | 18.75,57.35 18.75,59.33 19.05,59.64 R1.1 | 18.75,57.35 33.22,57.35 R2.1 | C15.1 19.05,34.8 21.95,37.69 21.95,39.06 23.16,40.28 23.16,41.05 20.88,43.33 20.88,47.75
  Bottom 0.152: v57.61,55.98 58.67,55.98 63.55,51.11 67.67,51.11 68.58,50.19 | 68.58,50.19 D1.C 68.58,49.58 | v53.34,41.5 53.34,45.31 53.65,45.62 53.65,48.21 57,51.56 v57.3,51.56 57.3,52.48 57.45,52.63 57.45,53.24 56.54,54.15 54.71,54.15 47.85,61.01 47.7,61.01 46.79,61.93 41.15,61.93 40.54,62.54 38.41,62.54 R2.1 35.51,59.64 35.51,56.13 31.24,51.87 31.24,49.43 31.39,49.28 X1.5 31.39,49.12 30.48,48.21 30.48,46.38 31.39,45.47 31.39,41.5 | 68.58,50.19 78.03,59.64 81.23,59.64 R4.2 | 58.37,22.3 56.24,22.3 55.78,22.76 55.78,25.65 54.56,26.87 53.95,26.87 52.73,25.65 52.12,25.65 51.97,25.81 v47.7,25.81 47.09,25.81 45.26,23.98 41.91,23.98 41.6,23.67 41.6,22.76 42.22,22.15 42.22,21.54 41.91,21.23 41.3,21.23 40.84,21.69 40.84,23.98 40.54,24.28 37.03,24.28 35.66,22.91 C14.2 35.51,22.76 34.44,21.69 32.46,21.69 31.09,20.32 C7.2 28.65,20.32 27.28,18.95 21.64,18.95 C2.2 | 58.37,22.3 58.98,22.91 S1.3 66.45,22.91 67.82,24.28 67.82,26.57 74.98,33.73 78.64,33.73 80.01,35.1 C13.2 | S1.4 69.04,22.91 67.51,21.39 58.67,21.39 58.37,21.69 58.37,22.3 | C2.2 20.42,17.88 12.5,17.88 11.43,18.95 7.62,18.95 X3.C1 | C2.2 21.64,19.1 21.64,25.35 C1.2 19.05,27.94 C15.1 | X3.C16 7.62,57.2 10.82,57.2 13.26,59.64 19.05,59.64 R1.1 | 31.39,41.5 29.26,39.37 C5.1 | C6.1 34.44,39.37 32.77,41.05 31.85,41.05 31.39,41.5
N$29  (via drill 0.35)
  Top 0.152: v61.27,40.89 61.27,42.27 U$1.14 | v68.12,35.41 68.73,35.41 72.69,31.45 78.18,31.45 80.01,29.62 v80.01,14.99 | v21.95,15.75 21.03,14.83 21.03,14.22 J1.2
  Bottom 0.152: v61.27,40.89 61.27,40.44 65.53,36.17 67.36,36.17 v68.12,35.41 | v80.01,14.99 72.69,14.99 72.08,14.38 58.98,14.38 57.76,13.16 34.14,13.16 31.55,15.75 v21.95,15.75
N$30  (via drill 0.35)
  Top 0.152: v64.92,40.44 62.18,40.44 61.87,40.74 61.87,42.27 U$1.13 | v66.75,38.61 67.82,38.61 68.73,37.69 v72.39,37.69 | v70.87,31.9 70.87,28.09 75.89,23.06 75.89,16.36 v71.93,12.39 | v34.59,12.24 23.32,12.24 22.25,13.31 22.25,14.07 J1.3
  Bottom 0.152: v66.75,38.61 v64.92,40.44 | v72.39,37.69 70.87,36.17 v70.87,31.9 | v71.93,12.39 34.75,12.39 v34.59,12.24
N$31  (via drill 0.35)
  Top 0.152: v57,44.4 58.06,45.47 58.52,45.47 U$2.7 | v54.1,35.1 53.65,35.1 49.07,30.53 48.46,30.53 44.35,26.42 44.35,24.13 IC1.18
  Bottom 0.152: v57,44.4 57,42.57 56.54,42.11 56.54,39.98 54.71,38.15 54.71,35.71 v54.1,35.1
N$32  (via drill 0.35)
  Top 0.152: v43.74,44.7 44.65,43.79 52.27,43.79 54.41,45.92 58.52,45.92 U$2.6 | v38.1,51.26 v39.47,49.89 | v39.78,59.79 41.76,61.77 v41.76,66.5 | v87.63,29.31 87.63,27.79 87.33,27.48 87.33,26.26 86.72,25.65 84.28,25.65 80.31,29.62 80.31,29.77 77.57,32.51 72.08,32.51 68.58,36.02 66.6,36.02 65.38,34.8 64.92,34.8 61.11,30.99 61.11,29.46 61.42,29.16 62.33,29.16 63.09,28.4 63.09,22.45 62.03,21.39 59.74,21.39 57.61,19.25 44.04,19.25 43.28,20.02 43.28,21.54 45.11,23.37 45.11,23.98 IC1.19
  Bottom 0.152: v43.74,44.7 43.74,45.16 40.84,48.06 39.93,48.06 39.47,48.51 v39.47,49.89 | v38.1,51.26 38.1,52.63 38.41,52.93 38.41,58.42 v39.78,59.79 | v41.76,66.5 43.89,68.63 58.67,68.63 61.11,66.19 81.23,66.19 85.65,61.77 85.65,58.57 91.14,53.09 91.9,53.09 93.73,51.26 93.73,35.1 91.44,32.82 91.14,32.82 v87.63,29.31
N$33  (via drill 0.35)
  Top 0.152: v54.86,52.02 54.86,51.11 56.54,49.43 59.44,49.43 U$2.28 | v31.09,47.75 25.45,47.75 U2.9 v23.62,45.92 | v44.5,32.05 42.37,29.92 41.91,29.92 IC1.11
  Bottom 0.152: v54.86,52.02 49.84,57.05 46.79,57.05 44.2,54.46 42.22,54.46 39.01,51.26 39.01,50.8 35.97,47.75 33.38,47.75 | v31.09,47.75 33.38,47.75 | v44.5,32.05 44.5,35.1 42.37,37.24 32.31,37.24 30.63,38.91 30.63,39.83 31.24,40.44 32.92,40.44 35.05,38.3 35.97,38.3 36.73,39.06 36.73,39.68 34.75,41.66 33.68,41.66 33.38,41.96 33.38,47.75 | v23.62,45.92 21.03,43.33 21.03,38.15 X2.3
N$34
  Top 0.152: U2.1 20.42,56.44 20.88,56.44 23.01,54.3 23.01,41.66 23.47,41.2 23.47,39.37 22.25,38.15 22.25,34.95 21.64,34.34 21.64,31.75 C15.2
N$36  (via drill 0.35)
  Top 0.152: v37.49,30.53 41.76,30.53 IC1.10 | v35.51,28.55 30.48,28.55 29.72,29.31 24.99,29.31 23.47,27.79 v17.68,27.79 | v17.37,51.41 19.81,53.85 20.27,53.85 U2.3
  Bottom 0.152: v35.51,28.55 v37.49,30.53 | v17.68,27.79 17.68,37.54 16.76,38.46 16.76,50.8 v17.37,51.41
N$37  (via drill 0.35)
  Top 0.152: 19.05,44.86 19.05,43.79 22.1,40.74 X2.4 | 19.05,44.86 19.05,50.49 19.96,51.41 20.27,51.41 U2.5 | v57.15,47.9 58.52,47.9 U$2.2 | v50.14,34.34 v54.1,38.3 | v47.09,33.73 42.37,29.01 41.91,29.01 IC1.12 | 19.05,44.86 17.07,44.86 14.78,47.14 14.78,59.64 23.77,68.63 42.67,68.63 43.89,67.41 49.23,67.41 49.53,67.72 50.14,67.72 55.63,62.23 v55.63,61.01
  Bottom 0.152: v54.1,38.3 56.24,40.44 56.24,44.09 56.39,44.25 56.39,45.16 57.15,45.92 v57.15,47.9 59.28,50.04 59.28,51.87 55.63,55.52 v55.63,61.01 | v50.14,34.34 47.7,34.34 v47.09,33.73
N$38
  Top 0.152: J3.2 45.11,54.76 45.11,55.07 43.43,56.74 26.82,56.74 26.52,57.05 19.2,57.05 19.05,56.9 19.05,56.13 19.81,55.37 20.27,55.37 U2.2
N$39  (1 unrouted)
N$40  (via drill 0.35)
  Top 0.152: v48.46,56.13 48.46,54.76 J3.5 | v34.75,52.02 v41.15,52.02 | v32.31,52.02 28.8,52.02 25.76,48.97 25.45,48.97 U2.10
  Bottom 0.152: v48.46,56.13 48.01,56.13 47.7,56.44 47.09,56.44 44.5,53.85 42.52,53.85 41.15,52.48 v41.15,52.02 | v32.31,52.02 v34.75,52.02
N$43  (via drill 0.35)
  Top 0.152: 52.27,55.52 52.73,55.07 52.73,51.41 55.63,48.51 58.52,48.51 U$2.1 | 52.27,55.52 51.21,55.52 50.75,55.07 50.75,54.76 J3.7 | v37.95,28.7 40.08,28.7 40.54,28.25 41.76,28.25 IC1.13 | v36.42,27.18 36.42,26.72 34.14,24.44 34.14,22.45 33.38,21.69 30.94,21.69 v28.8,23.82 | v23.93,24.74 23.32,24.74 v22.71,24.13 | 52.27,55.52 52.27,55.98 v53.03,56.74 | v48.01,61.62 48.01,63.14 46.79,64.36 v42.67,64.36 | v19.66,63.14 19.2,63.14 16.76,60.71 16.76,46.08 v17.37,45.47
  Bottom 0.152: v36.42,27.18 v37.95,28.7 | v28.8,23.82 24.84,23.82 v23.93,24.74 | v22.71,24.13 22.71,32.66 22.86,32.82 22.86,33.43 18.29,38 X2.1 18.29,38.15 17.37,39.06 v17.37,45.47 | v53.03,56.74 52.58,56.74 48.01,61.32 v48.01,61.62 | v42.67,64.36 41.76,64.36 41.45,64.06 33.53,64.06 32.61,63.14 v19.66,63.14
N$44  (via drill 0.35)
  Top 0.152: U$2.25 60.96,49.89 60.35,50.49 v56.84,50.49 | v38.71,42.72 38.71,41.5 36.73,39.52 36.73,38.61 33.53,35.41 v33.53,33.27 | v34.14,29.46 35.51,29.46 37.19,27.79 37.8,27.79 v39.62,25.96 | v40.84,25.04 40.84,26.26 41.15,26.57 41.76,26.57 IC1.15
  Bottom 0.152: v56.84,50.49 56.84,50.04 53.95,47.14 53.95,41.05 50.6,37.69 49.07,37.69 41.6,45.16 41.6,46.84 40.69,47.75 40.08,47.75 38.71,46.38 v38.71,42.72 | v33.53,33.27 33.53,30.07 v34.14,29.46 | v39.62,25.96 39.93,25.96 v40.84,25.04
N$45  (via drill 0.35)
  Top 0.152: v35.2,66.8 38.41,63.6 38.41,60.25 41.6,57.05 45.26,57.05 47.24,55.07 47.24,54.76 J3.4 | v62.33,66.8 62.33,66.34 67.51,61.16 67.51,53.54 73,48.06 v73,44.09
  Bottom 0.152: v35.2,66.8 41.15,66.8 43.43,69.09 60.05,69.09 v62.33,66.8 | v73,44.09 73.91,43.18 73.91,41.66 71.63,39.37 C16.2
N$47  (via drill 0.35)
  Top 0.152: v55.47,54.76 55.47,50.95 56.54,49.89 57.15,49.89 57.45,50.19 60.05,50.19 60.35,49.89 60.35,49.43 U$2.26 | v38.1,24.89 39.93,23.06 40.54,23.06 41.76,24.28 41.76,25.81 IC1.16
  Bottom 0.152: v55.47,54.76 55.47,55.22 53.34,57.35 52.43,57.35 48.62,61.16 48.62,61.93 48.31,62.23 41.6,62.23 41,62.84 35.36,62.84 34.59,62.08 32.77,62.08 32.61,62.23 26.67,62.23 24.23,59.79 24.23,41.5 23.16,40.44 23.16,39.06 22.55,38.46 22.55,35.56 23.32,34.8 23.32,22.15 26.21,19.25 27.13,19.25 28.04,20.17 28.04,20.62 29.87,22.45 31.09,22.45 33.53,24.89 v38.1,24.89
N$48  (via drill 0.35)
  Top 0.152: v44.96,44.4 45.26,44.09 48.31,44.09 48.92,44.7 52.73,44.7 54.25,46.23 56.39,46.23 57.61,47.45 58.52,47.45 U$2.3 | v40.23,48.67 37.34,48.67 v35.36,50.65 | v33.07,51.41 31.85,51.41 v30.48,50.04 | v35.2,30.53 35.2,30.23 37.34,28.09 40.23,28.09 40.84,27.48 41.76,27.48 IC1.14
  Bottom 0.152: v44.96,44.4 40.69,48.67 v40.23,48.67 | v35.36,50.65 34.9,50.65 34.14,51.41 v33.07,51.41 | v30.48,50.04 30.48,48.67 30.18,48.36 30.18,46.23 31.09,45.31 31.09,42.11 29.41,40.44 28.8,40.44 28.04,39.68 28.04,38.15 30.48,35.71 34.44,35.71 34.9,35.26 34.9,30.84 v35.2,30.53
N$49
  Top 0.152: U$2.9 59.89,44.55 59.89,44.09 58.06,42.27 58.06,39.98 48.92,30.84 48.31,30.84 43.74,26.26 43.74,24.13 IC1.17
N$50  (via drill 0.35)
  Top 0.152: v56.08,27.33 57.15,27.33 IC1.35 | v80.16,48.97 v80.16,45.01 | v80.16,53.85 76.35,57.66 76.35,68.02 74.68,69.7 20.42,69.7 12.8,62.08 12.8,58.73 11.73,57.66 11.73,55.52 12.65,54.61 X3.A15
  Bottom 0.152: v56.08,27.33 56.08,22.91 56.39,22.61 58.22,22.61 59.74,24.13 67.21,24.13 67.51,24.44 67.51,25.04 66.29,26.26 66.29,26.87 69.49,30.07 69.95,30.07 76.35,36.47 76.35,39.22 77.57,40.44 77.57,42.42 v80.16,45.01 | v80.16,53.85 v80.16,48.97
N$51  (via drill 0.35)
  Top 0.152: v53.49,30.07 55.32,28.25 57.15,28.25 IC1.36 | v50.14,33.43 46.79,30.07 46.79,29.77 42.67,25.65 42.67,24.74 v38.25,20.32 | v11.58,17.58 10.52,17.58 7.77,20.32 7.01,20.32 5.49,21.84 5.49,28.55 7.62,30.68 7.92,30.68 v10.21,32.97
  Bottom 0.152: v50.14,33.43 v53.49,30.07 | v38.25,20.32 31.55,20.32 28.8,17.58 v11.58,17.58 | v10.21,32.97 10.21,45.92 12.8,48.51 13.11,48.51 13.72,49.12 13.72,51.11 12.8,52.02 X3.A14
N$52  (via drill 0.35)
  Top 0.152: v54.71,31.14 56.84,29.01 57.15,29.01 IC1.37 | v58.67,51.41 62.64,51.41 64.31,53.09 v64.31,55.68
  Bottom 0.152: v54.71,31.14 54.71,33.58 53.49,34.8 53.49,40.13 55.93,42.57 55.93,44.55 56.08,44.7 56.08,46.84 55.93,46.99 55.93,48.67 v58.67,51.41 | v64.31,55.68 57.76,62.23 57.76,62.84 57.45,63.14 45.41,63.14 44.81,63.75 33.68,63.75 32.46,62.54 15.54,62.54 11.12,58.12 7.16,58.12 6.55,57.51 6.55,56.74 7.62,55.68 7.92,55.68 11.73,51.87 11.73,50.49 X3.A13
N$53  (via drill 0.35)
  Top 0.152: v14.33,36.17 14.33,34.49 18.75,30.07 22.4,30.07 22.71,30.38 24.23,30.38 24.38,30.53 32.31,30.53 33.68,31.9 34.14,31.9 39.78,37.54 41.76,37.54 IC1.1 | v10.82,37.85 10.06,37.85 7.47,35.26 7.16,35.26 4.57,32.66 4.57,15.44 15.85,4.17 79.4,4.17 86.26,11.02 86.26,16.51 X4.C1
  Bottom 0.152: v14.33,36.17 14.33,36.63 13.11,37.85 v10.82,37.85
N$54  (via drill 0.35)
  Top 0.152: v38.86,35.26 41.76,35.26 IC1.4 | v35.81,35.26 35.51,35.26 v34.29,34.04 | v34.29,30.38 33.53,30.38 32.77,29.62 24.84,29.62 24.54,29.31 23.32,29.31 22.1,28.09 18.29,28.09 17.98,28.4 13.26,28.4 13.11,28.25 6.4,28.25 6.1,27.94 v6.1,25.96 | X4.C2 v80.16,12.85
  Bottom 0.152: v35.81,35.26 v38.86,35.26 | v34.29,30.38 v34.29,34.04 | v6.1,25.96 6.1,12.7 8.99,9.8 77.11,9.8 v80.16,12.85
N$55  (via drill 0.35)
  Top 0.152: v40.39,34.65 41.76,34.65 IC1.5 | v30.63,37.39 28.35,37.39 v27.13,38.61 | v26.98,61.62 26.98,62.08 v32.61,67.72 | v87.63,19.41 v89,18.03
  Bottom 0.152: v40.39,34.65 39.01,36.02 35.05,36.02 34.14,36.93 31.09,36.93 v30.63,37.39 | v27.13,38.61 27.13,58.57 26.98,58.73 v26.98,61.62 | v32.61,67.72 33.38,67.72 36.27,70.61 62.18,70.61 66.29,66.5 81.38,66.5 85.95,61.93 85.95,58.73 91.29,53.39 92.05,53.39 94.03,51.41 94.03,22.76 91.29,20.02 90.98,20.02 v89,18.03 | v87.63,19.41 87.63,20.32 X4.C3
N$56
  Top 0.152: IC1.6 41.76,33.58 36.73,33.58 34.14,30.99 33.68,30.99 32.61,29.92 24.69,29.92 24.54,29.77 23.32,29.77 21.95,28.4 20.12,28.4 19.81,28.7 17.22,28.7 12.65,33.27 12.34,33.27 11.73,33.88 11.73,34.8 12.8,35.87 13.11,35.87 13.87,36.63 13.87,62.69 20.57,69.39 74.52,69.39 76.05,67.87 76.05,54 82.6,47.45 82.6,44.25 86.41,40.44 86.72,40.44 90.37,36.78 90.37,36.47 91.59,35.26 91.9,35.26 92.51,34.65 92.51,33.88 91.44,32.82 91.14,32.82 90.07,31.75 90.07,29.77 87.63,27.33 87.63,25.35 86.41,24.13 X4.C4
N$57  (via drill 0.35)
  Top 0.152: v46.18,30.07 46.18,30.68 48.01,32.51 48.01,37.85 49.07,38.91 49.07,39.37 IC1.57 | v47.55,28.25 47.55,27.79 45.87,26.11 45.41,26.11 v44.96,25.65 | v41.6,21.84 41.6,21.23 43.89,18.95 v58.22,18.95 | v58.22,17.73 61.27,17.73 v63.7,20.17 | v82.91,27.94 84.58,27.94 85.8,26.72 86.26,26.72 X4.C5
  Bottom 0.152: v46.18,30.07 46.18,29.62 v47.55,28.25 | v44.96,25.65 43.13,25.65 41.3,23.82 41.3,22.15 v41.6,21.84 | v58.22,17.73 v58.22,18.95 | v63.7,20.17 75.13,20.17 v82.91,27.94
N$58  (via drill 0.35)
  Top 0.152: v42.98,28.09 47.7,32.82 47.7,38 48.31,38.61 48.31,39.37 IC1.58 | v37.34,27.18 36.42,26.26 36.42,23.52 36.73,23.22 v36.73,19.71
  Bottom 0.152: v42.98,28.09 41.15,28.09 39.93,26.87 37.64,26.87 v37.34,27.18 | v36.73,19.71 36.73,18.8 35.36,17.42 35.36,14.83 34.59,14.07 33.68,14.07 31.39,16.36 21.64,16.36 21.34,16.05 21.34,15.44 22.25,14.53 32.31,14.53 33.98,12.85 58.37,12.85 59.59,14.07 82.45,14.07 86.41,18.03 87.17,18.03 89.15,20.02 89.15,26.42 X4.C6
N$59  (via drill 0.35)
  Top 0.152: v39.01,31.14 40.69,32.82 41.76,32.82 IC1.7 | X3.C2 7.62,21.69 8.23,21.69 11.73,25.2 13.11,25.2 15.24,23.06 23.32,23.06 23.47,23.22 v23.93,23.22 27.89,23.22 31.39,19.71 v31.85,19.71 | v60.2,43.48 60.05,43.33 60.05,42.42 U$1.16 | v83.21,46.53 85.34,46.53 86.41,45.47 86.72,45.47 90.37,41.81 90.37,41.5 91.44,40.44 91.75,40.44 93.73,38.46 93.73,32.66 91.29,30.23 90.98,30.23 89.31,28.55 89.31,22.76 87.94,21.39 87.94,20.02 | X4.A1 87.94,20.02 | v73.76,15.6 60.66,15.6 58.52,13.46 37.03,13.46 35.36,15.14 34.29,15.14 C10.1 | v81.53,15.6 85.95,20.02 87.94,20.02
  Bottom 0.152: v39.01,31.14 34.44,26.57 33.07,26.57 29.72,23.22 v23.93,23.22 | C10.1 34.29,17.27 v31.85,19.71 | v60.2,43.48 65.08,43.48 68.12,46.53 v83.21,46.53 | v81.53,15.6 v73.76,15.6
N$60  (via drill 0.35)
  Top 0.152: v43.28,37.69 43.28,33.12 42.37,32.21 41.91,32.21 IC1.8 | v30.33,34.34 v34.14,38.15 | v29.72,28.4 29.41,28.4 28.8,29.01 28.04,29.01 26.82,27.79 25.45,27.79 21.95,24.28 v17.98,24.28
  Bottom 0.152: v43.28,37.69 42.82,37.69 42.52,38 34.29,38 v34.14,38.15 | v30.33,34.34 30.33,29.01 v29.72,28.4 | v17.98,24.28 16.76,24.28 13.11,20.62 11.12,20.62 X3.C3
N$61  (via drill 0.35)
  Top 0.152: v56.69,24.13 55.47,24.13 IC1.32 | v66.14,25.35 66.14,24.13 v73.76,16.51 | v71.78,14.99 60.5,14.99 58.37,12.85 v29.57,12.85
  Bottom 0.152: v56.69,24.13 58.83,24.13 59.74,25.04 65.84,25.04 v66.14,25.35 | v73.76,16.51 73.3,16.51 v71.78,14.99 | v29.57,12.85 15.39,12.85 10.21,18.03 7.16,18.03 6.55,18.64 6.55,25.5 7.62,26.57 X3.C4
N$62  (via drill 0.35)
  Top 0.152: v40.39,31.14 40.54,31.29 41.76,31.29 IC1.9 | v39.62,27.48 39.62,26.87 40.23,26.26 v40.23,23.67 | v37.03,18.19 22.25,18.19 21.95,17.88 17.83,17.88 12.65,23.06 v11.12,23.06
  Bottom 0.152: v40.39,31.14 40.39,28.25 v39.62,27.48 | v40.23,23.67 40.23,21.39 v37.03,18.19 | v11.12,23.06 11.12,25.65 7.62,29.16 X3.C5
N$63  (via drill 0.35)
  Top 0.152: v51.66,40.74 51.51,40.59 51.51,39.52 IC1.54 | v42.06,56.13 v42.06,52.48 | v46.48,63.75 v42.06,59.33 | v60.35,62.23 v57.91,64.67 | v81.23,62.54 81.69,62.54 86.26,57.96 86.26,54.61 X4.C16
  Bottom 0.152: v51.66,40.74 51.21,40.28 49.84,40.28 46.18,43.94 46.18,45.47 42.82,48.82 42.37,48.82 42.06,49.12 v42.06,52.48 | v42.06,59.33 v42.06,56.13 | v46.48,63.75 48.31,63.75 49.23,64.67 v57.91,64.67 | v60.35,62.23 80.92,62.23 v81.23,62.54
N$64  (via drill 0.35)
  Top 0.152: v50.75,40.89 50.75,39.52 IC1.55 | v48.77,57.96 48.77,61.01 49.84,62.08 v49.84,67.11
  Bottom 0.152: v50.75,40.89 50.75,43.64 52.43,45.31 52.43,48.21 55.47,51.26 55.47,52.32 50.44,57.35 49.38,57.35 v48.77,57.96 | v49.84,67.11 57.91,67.11 59.44,65.58 80.01,65.58 85.04,60.55 85.04,53.39 X4.C15
N$65  (via drill 0.35)
  Top 0.152: v30.48,45.01 40.08,45.01 42.22,42.88 47.7,42.88 47.85,43.03 50.29,43.03 50.6,42.72 50.6,42.11 49.99,41.5 49.99,39.52 IC1.56 | v32.31,61.62 32.31,64.67 v32.92,65.28
  Bottom 0.152: v30.48,45.01 30.48,45.47 29.87,46.08 29.87,51.41 32.31,53.85 v32.31,61.62 | v32.92,65.28 44.5,65.28 45.11,65.89 57.76,65.89 59.89,63.75 81.38,63.75 84.73,60.4 84.73,51.11 86.26,49.58 X4.C14
N$66
  Top 0.152: IC1.44 57.3,34.65 57.91,34.65 59.44,36.17 59.44,37.08 61.57,39.22 66.9,39.22 71.17,43.48 80.77,43.48 86.11,38.15 87.63,38.15 91.44,34.34 X4.A8
N$67  (via drill 0.35)
  Top 0.152: v56.08,35.26 57.15,35.26 IC1.45 | v62.94,30.38 64.47,30.38 71.17,23.67 71.17,21.54 v74.98,17.73 | v85.34,28.09 85.34,32.21 86.41,33.27 86.72,33.27 v87.63,34.19
  Bottom 0.152: v56.08,35.26 58.06,35.26 v62.94,30.38 | v85.34,28.09 v74.98,17.73 | v87.63,34.19 87.63,35.26 87.48,35.41 87.48,36.02 88.24,36.78 91.44,36.78 X4.A9
N$68  (via drill 0.35)
  Top 0.152: v59.44,38 59.44,37.69 57.91,36.17 57.3,36.17 IC1.46 | v67.51,38 v62.33,38 | v83.21,45.62 83.82,45.62 86.26,43.18 87.63,43.18 X4.A10
  Bottom 0.152: v62.33,38 v59.44,38 | v67.51,38 69.65,38 69.95,37.69 71.02,37.69 78.94,45.62 v83.21,45.62
N$69  (via drill 0.35)
  Top 0.152: v56.08,36.63 56.24,36.78 57.15,36.78 IC1.47 | v65.23,33.73 69.95,33.73 72.54,31.14 77.27,31.14 v77.57,30.84
  Bottom 0.152: v56.08,36.63 62.33,36.63 v65.23,33.73 | v77.57,30.84 77.57,31.29 85.34,39.06 85.34,39.83 86.41,40.89 90.53,40.89 91.44,41.81 X4.A11
N$70  (via drill 0.35)
  Top 0.152: v62.79,39.83 59.44,39.83 57.3,37.69 IC1.48 | v70.26,38.3 74.37,38.3 76.96,35.71 v88.09,35.71
  Bottom 0.152: v62.79,39.83 61.87,40.74 61.87,41.35 62.48,41.96 64.47,41.96 68.12,38.3 v70.26,38.3 | v88.09,35.71 91.75,35.71 92.81,36.78 92.81,43.03 91.44,44.4 X4.A12
N$71  (via drill 0.35)
  Top 0.152: v58.22,44.7 55.47,41.96 55.47,39.52 IC1.49 | v63.4,49.89 63.86,49.89 v64.77,48.97 | v67.36,50.49 67.36,52.02 67.67,52.32 68.28,52.32 70.26,50.34 v70.26,49.89 | v78.33,56.74 82.75,56.74 86.41,53.09 89,53.09 91.59,50.49 91.9,50.49 92.51,49.89 92.51,48.06 X4.A13
  Bottom 0.152: v63.4,49.89 v58.22,44.7 | v64.77,48.97 66.14,48.97 67.36,50.19 v67.36,50.49 | v70.26,49.89 70.71,49.89 77.57,56.74 v78.33,56.74
N$72  (via drill 0.35)
  Top 0.152: v57.45,40.28 55.78,38.61 55.02,38.61 54.71,38.91 54.71,39.37 IC1.50 | v78.94,55.98 81.08,55.98 86.56,50.49 90.53,50.49 91.44,49.58 X4.A14
  Bottom 0.152: v57.45,40.28 57.45,42.11 63.7,48.36 69.65,48.36 77.27,55.98 v78.94,55.98
N$73  (via drill 0.35)
  Top 0.152: v49.38,38.3 49.99,37.69 52.58,37.69 53.8,38.91 53.8,39.37 IC1.51 | v34.75,46.08 30.33,46.08 29.26,47.14 v28.65,47.14 | v31.39,58.27 31.39,58.57 31.55,58.73 31.55,60.55 30.79,61.32 30.79,64.97 v32,66.19
  Bottom 0.152: v49.38,38.3 49.38,39.22 45.57,43.03 45.57,44.7 41.6,48.67 41.15,48.67 40.08,49.73 40.08,50.19 39.78,50.49 39.17,50.49 v34.75,46.08 | v28.65,47.14 28.65,51.41 31.39,54.15 v31.39,58.27 | v32,66.19 41.15,66.19 41.45,65.89 44.2,65.89 46.02,67.72 57.76,67.72 59.59,65.89 81.08,65.89 85.34,61.62 85.34,58.12 91.44,52.02 X4.A15
N$74  (via drill 0.35)
  Top 0.152: v58.52,26.26 58.22,25.96 57.3,25.96 IC1.33 | v61.72,29.77 64.62,29.77 70.87,23.52 70.87,20.93 v74.98,16.82 | v88.54,21.08 88.54,21.54 90.37,23.37 90.37,27.03 91.59,28.25 91.9,28.25 94.64,30.99 94.64,51.41 X4.A16
  Bottom 0.152: v58.52,26.26 58.52,27.94 60.35,29.77 v61.72,29.77 | v74.98,16.82 79.55,16.82 85.34,22.61 87.02,22.61 v88.54,21.08
N$75  (via drill 0.35)
  Top 0.152: v49.84,25.2 49.84,24.13 IC1.25 | v42.22,23.37 41,22.15 41,18.49 41.45,18.03 41.45,16.36 40.84,15.75 40.84,14.83 41.6,14.07 49.99,14.07 v50.29,14.38
  Bottom 0.152: v49.84,25.2 47.7,25.2 45.87,23.37 v42.22,23.37 | v50.29,14.38 50.75,14.38 51.66,13.46 57.61,13.46 60.66,16.51 72.85,16.51 85.34,29.01 85.34,33.27 X4.C8
N$76  (via drill 0.35)
  Top 0.152: v50.75,22.76 50.75,23.98 IC1.26 | v56.08,17.27 57.76,17.27 57.91,17.12 v60.66,17.12
  Bottom 0.152: v50.75,22.76 51.21,22.76 53.49,20.47 53.49,19.86 v56.08,17.27 | v60.66,17.12 73,17.12 85.04,29.16 85.04,35.56 86.26,36.78 X4.C9
N$77  (via drill 0.35)
  Top 0.152: v52.58,22.76 53.03,23.22 53.03,23.98 IC1.29
  Bottom 0.152: v52.58,22.76 52.12,22.76 51.21,23.67 47.09,23.67 45.72,22.3 43.89,22.3 39.93,18.34 39.93,17.27 40.84,16.36 49.23,16.36 51.82,13.77 57.45,13.77 60.05,16.36 60.05,17.42 63.4,20.78 74.37,20.78 84.43,30.84 84.43,37.24 86.26,39.06 86.26,39.37 X4.C10
N$78  (via drill 0.35)
  Top 0.152: v49.07,29.62 49.99,29.62 53.8,25.81 53.8,24.13 IC1.30 | v40.39,47.14 42.06,48.82 42.06,50.19 v41.15,51.11 | v49.38,56.44 49.38,60.55 v52.88,64.06
  Bottom 0.152: v49.07,29.62 46.48,32.21 46.48,35.41 42.06,39.83 41.91,39.83 40.39,41.35 v40.39,47.14 | v41.15,51.11 40.54,51.71 40.54,52.32 42.37,54.15 44.35,54.15 46.94,56.74 49.07,56.74 v49.38,56.44 | v52.88,64.06 58.67,64.06 59.28,63.45 81.23,63.45 84.12,60.55 84.12,44.09 86.26,41.96 X4.C11
N$79  (via drill 0.35)
  Top 0.152: v56.69,23.22 56.54,23.06 55.02,23.06 54.71,23.37 54.71,23.98 IC1.31 | v66.9,26.57 v66.9,24.74 | v79.1,35.1 85.8,35.1 85.95,35.26 87.48,35.26 87.63,35.1 v88.85,35.1
  Bottom 0.152: v56.69,23.22 58.37,23.22 59.89,24.74 v66.9,24.74 | v66.9,26.57 75.89,35.56 78.64,35.56 v79.1,35.1 | v88.85,35.1 90.83,35.1 91.14,35.41 91.9,35.41 93.42,36.93 93.42,43.33 92.51,44.25 92.51,44.86 91.9,45.47 87.33,45.47 86.41,44.55 X4.C12
N$80  (via drill 0.35)
  Top 0.152: v55.47,32.97 57.15,32.97 IC1.42 | v66.45,50.19 66.45,61.77 v61.42,66.8 | v59.74,68.48 44.65,68.48 44.2,68.94 21.03,68.94 v14.48,62.38
  Bottom 0.152: v55.47,32.97 55.47,34.49 55.17,34.8 55.17,38.15 56.84,39.83 56.84,41.96 65.08,50.19 v66.45,50.19 | v59.74,68.48 v61.42,66.8 | v14.48,62.38 10.82,58.73 7.32,58.73 6.25,57.66 6.25,31.75 7.77,30.23 8.08,30.23 11.73,26.57 11.73,22.61 12.65,21.69 X3.A2
N$81  (via drill 0.35)
  Top 0.152: v59.28,32.21 57.3,32.21 IC1.41 | v63.4,29.01 64.92,29.01 65.53,28.4 65.53,21.08 58.22,13.77 41.45,13.77 40.54,14.68 40.54,16.66 41.15,17.27 41.15,17.88 39.93,19.1 23.01,19.1 19.36,22.76 14.17,22.76 12.8,24.13 X3.A3
  Bottom 0.152: v59.28,32.21 60.2,32.21 v63.4,29.01
N$82  (via drill 0.35)
  Top 0.152: v58.52,31.45 57.3,31.45 IC1.40 | v53.65,27.48 53.65,26.87 v54.25,26.26 | v37.19,17.27 12.8,17.27 9.45,20.62 7.16,20.62 6.55,21.23 6.55,22 7.62,23.06 9.14,23.06 12.65,26.57 X3.A4
  Bottom 0.152: v58.52,31.45 58.06,31.45 54.1,27.48 v53.65,27.48 | v54.25,26.26 53.8,26.26 51.82,24.28 47.24,24.28 45.57,22.61 43.13,22.61 42.52,22 42.52,21.39 38.41,17.27 v37.19,17.27
N$83  (via drill 0.35)
  Top 0.152: v56.08,31.29 56.69,30.68 57.15,30.68 IC1.39 | v65.99,34.49 65.08,34.49 64.62,34.04 64.62,30.68 71.48,23.82 71.48,22.15 75.59,18.03 75.59,16.51 72.85,13.77 59.74,13.77 56.54,10.57 16.61,10.57 9.14,18.03 7.16,18.03 4.88,20.32 4.88,30.38 7.77,33.27 9.6,33.27 9.91,33.58 10.52,33.58 11.12,32.97 11.12,30.84 12.65,29.31 X3.A5
  Bottom 0.152: v56.08,31.29 56.08,34.34 55.47,34.95 55.47,36.93 55.78,37.24 63.25,37.24 v65.99,34.49
N$84  (via drill 0.35)
  Top 0.152: v60.05,34.34 60.05,32.05 57.91,29.92 57.3,29.92 IC1.38 | v78.64,59.03 78.64,64.82 76.66,66.8 76.66,68.17 74.22,70.61 12.95,70.61 5.49,63.14 5.49,60.71 11.73,54.46 11.73,38.46 12.04,38.15 12.04,37.54 11.43,36.93 11.43,32.97 12.65,31.75 X3.A6
  Bottom 0.152: v60.05,34.34 59.44,34.95 59.44,35.56 59.74,35.87 62.18,35.87 64.92,33.12 65.53,33.12 66.6,34.19 66.6,34.8 65.53,35.87 65.38,35.87 59.59,41.66 59.59,43.79 63.09,47.3 78.33,47.3 79.55,48.51 79.55,58.12 v78.64,59.03
N$85
  Top 0.152: IC1.3 41.76,36.02 38.71,36.02 34.29,31.6 33.83,31.6 32.46,30.23 24.54,30.23 24.38,30.07 23.16,30.07 21.79,28.7 20.27,28.7 19.96,29.01 17.83,29.01 12.65,34.19 X3.A7
N$86  (via drill 0.35)
  Top 0.152: v39.78,36.63 39.93,36.78 41.76,36.78 IC1.2 | v37.95,36.63 36.42,35.1 36.42,34.95 35.81,34.34 35.51,34.34 32.77,31.6 v32.46,31.6 | v30.33,25.81 29.87,25.81 28.19,24.13 23.93,24.13 23.16,23.37 17.98,23.37 15.7,25.65 15.54,25.65 v14.17,27.03
  Bottom 0.152: v37.95,36.63 v39.78,36.63 | v32.46,31.6 32.46,27.94 v30.33,25.81 | v14.17,27.03 14.17,34.95 12.8,36.32 12.8,36.78 X3.A8
N$87  (via drill 0.35)
  Top 0.152: v34.14,35.1 37.34,38.3 46.79,38.3 47.55,39.06 47.55,39.37 IC1.59 | v28.35,35.1 24.23,35.1 v22.25,33.12
  Bottom 0.152: v28.35,35.1 v34.14,35.1 | v22.25,33.12 18.9,33.12 17.98,32.21 17.98,28.4 18.29,28.09 18.29,27.48 17.98,27.18 17.37,27.18 14.94,29.62 14.94,37.24 12.8,39.37 X3.A9
N$88  (via drill 0.35)
  Top 0.152: v49.07,41.96 48.77,41.96 46.79,39.98 46.79,39.52 IC1.60 | v42.67,49.43 42.67,48.51 40.69,46.53 39.47,46.53 v38.71,47.3 | v36.27,46.69 33.07,46.69 31.39,48.36 24.23,48.36 v23.62,48.97
  Bottom 0.152: v49.07,41.96 49.07,42.72 46.48,45.31 46.48,45.62 v42.67,49.43 | v38.71,47.3 36.88,47.3 v36.27,46.69 | v23.62,48.97 23.62,49.43 14.94,58.12 12.19,58.12 11.73,57.66 11.73,54.15 12.8,53.09 13.11,53.09 16,50.19 16,45.16 12.8,41.96 X3.A10
N$89  (via drill 0.35)
  Top 0.152: v49.99,42.42 49.84,42.57 48.62,42.57 46.02,39.98 46.02,39.52 IC1.61 | v47.4,55.83 46.94,55.83 45.41,57.35 44.81,57.35 v42.98,59.18 | v39.62,61.93 39.62,63.3 34.59,68.33 23.93,68.33 15.39,59.79 v15.39,47.45
  Bottom 0.152: v49.99,42.42 49.99,43.33 52.12,45.47 52.12,48.36 52.73,48.97 52.73,53.7 50.9,55.52 47.7,55.52 v47.4,55.83 | v42.98,59.18 42.98,59.64 40.69,61.93 v39.62,61.93 | v15.39,47.45 15.39,47.14 X3.A11
N$100  (via drill 0.35)
  Top 0.152: v46.33,27.48 46.33,27.94 48.62,30.23 49.23,30.23 52.58,33.58 57.15,33.58 IC1.43 | v23.93,30.99 22.86,30.99 22.25,30.38 18.9,30.38 14.94,34.34 v14.94,38.61
  Bottom 0.152: v46.33,27.48 44.96,27.48 40.69,31.75 37.8,31.75 30.94,24.89 26.98,24.89 23.93,27.94 v23.93,30.99 | v14.94,38.61 12.65,40.89 12.34,40.89 11.73,41.5 11.73,46.08 12.65,46.99 X3.A12

### Text on the board
Top: Microcontroller Board